# Altium project flb.PrjPCB
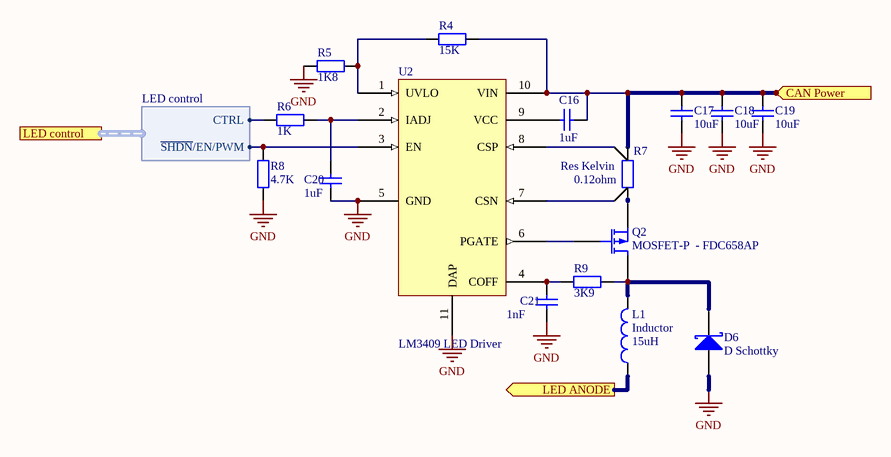
[diagram p0: LEDdriver-LM3409 - Strobe.SchDoc]
3 sheets, 32 parts. Net scope: flat (ports and power ports of the same name join across sheets).
Board file: FLB.PcbDoc
Sheets:
  LEDdriver-LM3409 - Strobe.SchDoc
  ethernet.SchDoc
  LEDdriver-LM3409.SchDoc

## Sheet LEDdriver-LM3409 - Strobe.SchDoc
size A4

### Parts
C16  value 1uF  [C0603]  (hidden comment: Cap)
C17  value 10uF  [Capacitor 1210 (3225) package]  (hidden comment: Cap)
C18  value 10uF  [Capacitor 1210 (3225) package]  (hidden comment: Cap)
C19  value 10uF  [Capacitor 1210 (3225) package]  (hidden comment: Cap)
C20  value 1uF  [C0603]  (hidden comment: Cap)
C21  value 1nF  [C0603]  (hidden comment: Cap)
D6  D Schottky  [Schottky rectifier]
L1  Inductor  value 15uH  [Inductor 3131]
Q2  MOSFET-P  - FDC658AP  [SuperSOT6 - FDC658AP]
R4  value 15K  [R0603]  (hidden comment: Res)
R5  value 1K8  [R0603]  (hidden comment: Res)
R6  value 1K  [R0603]  (hidden comment: Res)
R7  Res Kelvin  value 0.12ohm  [2512 package + Kelvin Cons - ERJ1TR Rsns]  (net tie)
R8  value 4.7K  [R0603]  (hidden comment: Res)
R9  value 3K9  [R0603]  (hidden comment: Res)
U2  LM3409 LED Driver  [10eMSOP + thermal pad - LM3409]

### Ports
CAN Power (in), LED ANODE (out), LED control (harness LED control)

### Harnesses
LED control: CTRL, ~{SHDN}/EN/PWM

### Nets
GND: C17.2 C18.2 C19.2 C20.2 C21.2 D6.1(A) R5.2 R8.1 U2.5(GND) U2.11(DAP)
NetC16_1: C16.1 C17.1 C18.1 C19.1 R4.1 R7.2 U2.10(VIN) ; port CAN Power
NetC16_2: C16.2 U2.9(VCC)
NetC20_1: C20.1 R6.1 U2.2(IADJ)
NetC21_1: C21.1 R9.2 U2.4(COFF)
NetD6_2: D6.2(K) L1.2 Q2.1(D) R9.1
NetL1_1: L1.1 ; port LED ANODE
NetQ2_2: Q2.2(G) U2.6(PGATE)
NetQ2_3: Q2.3(S) R7.1
NetR4_2: R4.2 R5.1 U2.1(UVLO)
NetR6_2: R6.2 ; port LED control.CTRL
NetR7_3: R7.3 U2.7(CSN)
NetR7_4: R7.4 U2.8(CSP)
NetR8_2: R8.2 U2.3(EN) ; port LED control.~{SHDN}/EN/PWM

### Library data of the parts
C16-C21 = Cap: Capacitor; Published: 8-Jun-2000; LatestRevisionDate: 17-Jul-2002; LatestRevisionNote: Re-released for DXP Platform.; PackageReference: RAD-0.3; Publisher: Altium Limited
  C16 C20: farnell: 1907508 £0.22
  C17-C19: farnell: 1735537 £2.18
  C21: farnell: 1759088
D6 = D Schottky: Schottky Diode; Published: 8-Jun-2000; LatestRevisionDate: 17-Jul-2002; LatestRevisionNote: Re-released for DXP Platform.; PackageReference: SMB; Publisher: Altium Limited; Code_JEDEC: DO-214-AA; farnell: 1467550 £0.21
L1 = Inductor: Code_IEC: 1005; Published: 8-Jun-2000; LatestRevisionDate: 29-May-2009; LatestRevisionNote: IPC-7351 Footprint Added.; PackageReference: 0402-A; Publisher: Altium Limited; PackageDescription: Chip Inductor; Code_JEITA: 0402; Farnell: 1782825 £0.33
Q2 = MOSFET-P: P-Channel MOSFET; Published: 8-Jun-2000; LatestRevisionDate: 17-Jul-2002; LatestRevisionNote: Re-released for DXP Platform.; PackageVersion: 1995/1996; PackageReference: E3; Publisher: Altium Limited; Farnell: 1495228 £0.68
R4-R6 R8 R9 = Res2: Resistor
  R4: farnell: 9330615
  R5: farnell: 9330712
  R6: farnell: 9330380
  R8: farnell: 9331247
  R9: farnell: 9331140
R7 = Res Kelvin: Resistor Kelvin; Published: 8-Jun-2000; LatestRevisionDate: 17-Jul-2002; LatestRevisionNote: Re-released for DXP Platform.; PackageReference: AXIAL-0.4; Publisher: Altium Limited
U2 = LM3409: PFET Buck Controller for High Power LED Drivers; Farnell: 1778582 £2.77

## Sheet ethernet.SchDoc
size A4
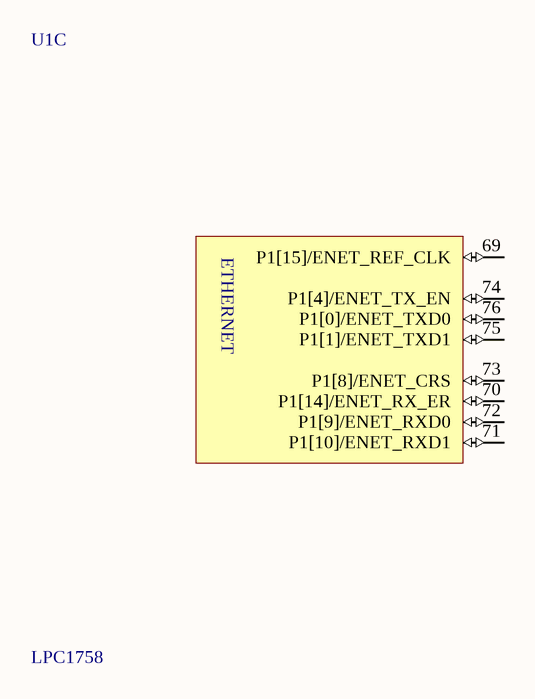
[diagram p1: ethernet.SchDoc]

### Parts
U1  LPC1758  [LPC1758FBD80]  (part C of 3)

### Nets

Not connected (* = marked no-connect by the designer): U1 69(P1[15]/ENET_REF_CLK) 70(P1[14]/ENET_RX_ER) 71(P1[10]/ENET_RXD1) 72(P1[9]/ENET_RXD0) 73(P1[8]/ENET_CRS) 74(P1[4]/ENET_TX_EN) 75(P1[1]/ENET_TXD1) 76(P1[0]/ENET_TXD0)

### Notes on the sheet
- (in symbol LPC1758, part C) ETHERNET

### Library data of the parts
U1 = LPC1758: NXP - LPC1758FBD80 - MCU, 32BIT, ARM CORTEX M3, 80LQFP; farnell: 1718545

## Sheet LEDdriver-LM3409.SchDoc
size A4
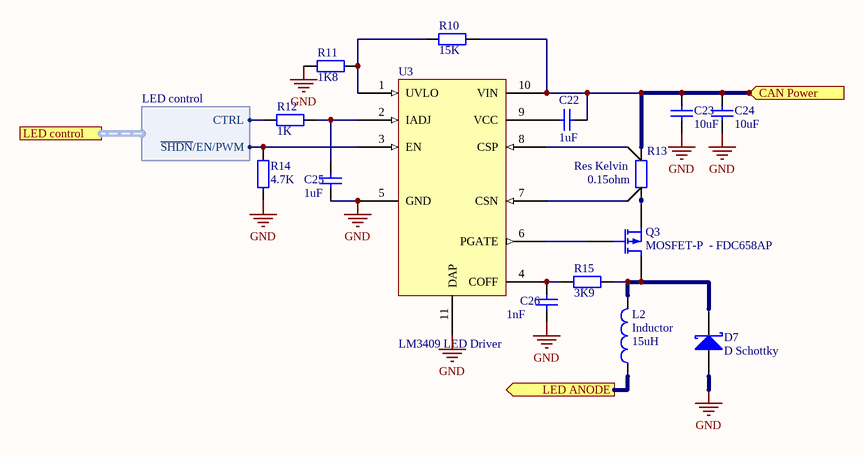
[diagram p2: LEDdriver-LM3409.SchDoc]

### Parts
C22  value 1uF  [C0603]  (hidden comment: Cap)
C23  value 10uF  [Capacitor 1210 (3225) package]  (hidden comment: Cap)
C24  value 10uF  [Capacitor 1210 (3225) package]  (hidden comment: Cap)
C25  value 1uF  [C0603]  (hidden comment: Cap)
C26  value 1nF  [C0603]  (hidden comment: Cap)
D7  D Schottky  [Schottky rectifier]
L2  Inductor  value 15uH  [Inductor 3131]
Q3  MOSFET-P  - FDC658AP  [SuperSOT6 - FDC658AP]
R10  value 15K  [R0603]  (hidden comment: Res)
R11  value 1K8  [R0603]  (hidden comment: Res)
R12  value 1K  [R0603]  (hidden comment: Res)
R13  Res Kelvin  value 0.15ohm  [2512 package + Kelvin Cons - ERJ1TR Rsns]  (net tie)
R14  value 4.7K  [R0603]  (hidden comment: Res)
R15  value 3K9  [R0603]  (hidden comment: Res)
U3  LM3409 LED Driver  [10eMSOP + thermal pad - LM3409]

### Ports
CAN Power (in), LED ANODE (out), LED control (harness LED control)

### Harnesses
LED control: CTRL, ~{SHDN}/EN/PWM

### Nets
GND: C23.2 C24.2 C25.2 C26.2 D7.1(A) R11.2 R14.1 U3.5(GND) U3.11(DAP)
NetC16_1: C22.1 C23.1 C24.1 R10.1 R13.2 U3.10(VIN) ; port CAN Power
NetC22_2: C22.2 U3.9(VCC)
NetC25_1: C25.1 R12.1 U3.2(IADJ)
NetC26_1: C26.1 R15.2 U3.4(COFF)
NetD7_2: D7.2(K) L2.2 Q3.1(D) R15.1
NetL1_1: L2.1 ; port LED ANODE
NetQ3_2: Q3.2(G) U3.6(PGATE)
NetQ3_3: Q3.3(S) R13.1
NetR6_2: R12.2 ; port LED control.CTRL
NetR8_2: R14.2 U3.3(EN) ; port LED control.~{SHDN}/EN/PWM
NetR10_2: R10.2 R11.1 U3.1(UVLO)
NetR13_3: R13.3 U3.7(CSN)
NetR13_4: R13.4 U3.8(CSP)

### Library data of the parts
C22-C26 = Cap: Capacitor; Published: 8-Jun-2000; LatestRevisionDate: 17-Jul-2002; LatestRevisionNote: Re-released for DXP Platform.; PackageReference: RAD-0.3; Publisher: Altium Limited
  C22 C25: farnell: 1907508 £0.22
  C23 C24: farnell: 1735537 £2.18
  C26: farnell: 1759088
D7 = D Schottky: Schottky Diode; Published: 8-Jun-2000; LatestRevisionDate: 17-Jul-2002; LatestRevisionNote: Re-released for DXP Platform.; PackageReference: SMB; Publisher: Altium Limited; Code_JEDEC: DO-214-AA; farnell: 1467550 £0.21
L2 = Inductor: Code_IEC: 1005; Published: 8-Jun-2000; LatestRevisionDate: 29-May-2009; LatestRevisionNote: IPC-7351 Footprint Added.; PackageReference: 0402-A; Publisher: Altium Limited; PackageDescription: Chip Inductor; Code_JEITA: 0402; Farnell: 1782825 £0.33
Q3 = MOSFET-P: P-Channel MOSFET; Published: 8-Jun-2000; LatestRevisionDate: 17-Jul-2002; LatestRevisionNote: Re-released for DXP Platform.; PackageVersion: 1995/1996; PackageReference: E3; Publisher: Altium Limited; Farnell: 1495228 £0.68
R10-R12 R14 R15 = Res2: Resistor
  R10: farnell: 9330615
  R11: farnell: 9330712
  R12: farnell: 9330380
  R14: farnell: 9331247
  R15: farnell: 9331140
R13 = Res Kelvin: Resistor Kelvin; Published: 8-Jun-2000; LatestRevisionDate: 17-Jul-2002; LatestRevisionNote: Re-released for DXP Platform.; PackageReference: AXIAL-0.4; Publisher: Altium Limited
U3 = LM3409: as U2 on sheet LEDdriver-LM3409 - Strobe; Farnell: 1778582 £2.77

## Nets that join several sheets
GND: LEDdriver-LM3409 - Strobe (10 pins), LEDdriver-LM3409 (9 pins)
NetC16_1: LEDdriver-LM3409 - Strobe (7 pins), LEDdriver-LM3409 (6 pins)
NetL1_1: LEDdriver-LM3409 - Strobe (L1.1), LEDdriver-LM3409 (L2.1)
NetR6_2: LEDdriver-LM3409 - Strobe (R6.2), LEDdriver-LM3409 (R12.2)
NetR8_2: LEDdriver-LM3409 - Strobe (R8.2 U2.3), LEDdriver-LM3409 (R14.2 U3.3)